# Altium schematic sheet Motor and Encoder.SchDoc
size Tabloid; SheetNumber: 3; SheetTotal: 11
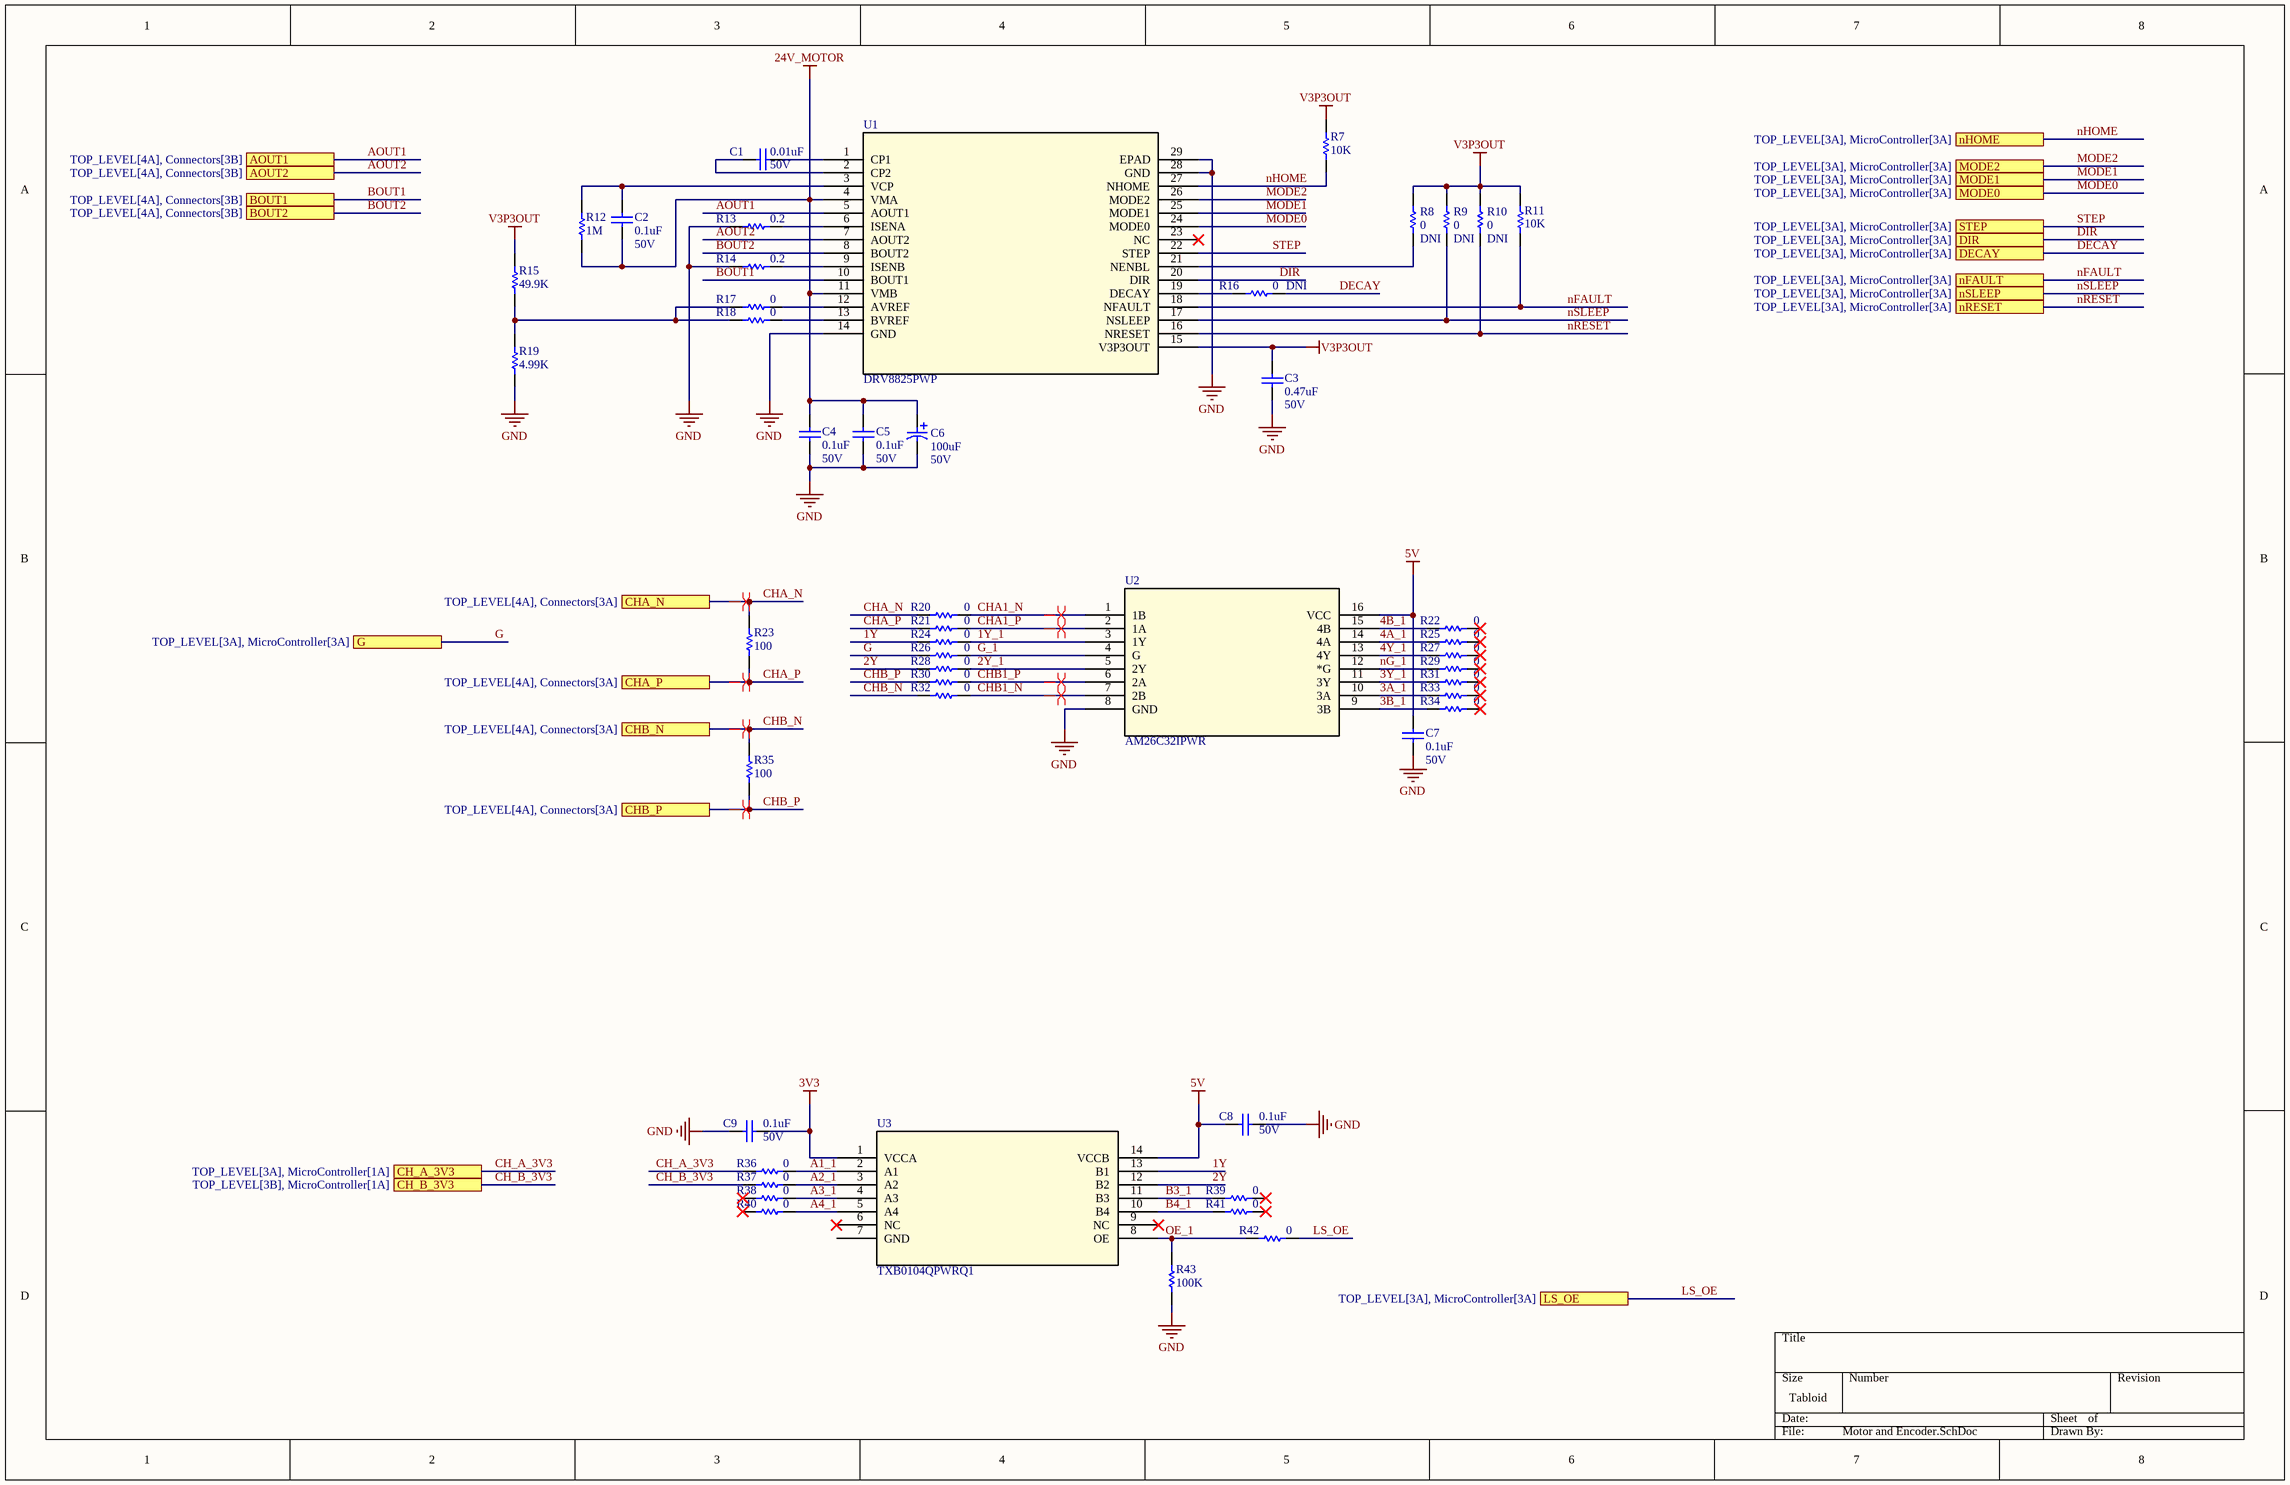
[diagram p0: Motor and Encoder.SchDoc]

## Parts
C1  value 0.01uF  Rating: 50V  [DEFAULT_CAPACITOR_0805]  (hidden comment: KGM21NR71H103KT)
C2  value 0.1uF  Rating: 50V  [DEFAULT_CAPACITOR_0805]  (hidden comment: KGM21NR71H104KT)
C3  value 0.47uF  Rating: 50V  [DEFAULT_CAPACITOR_0805]  (hidden comment: GRM21BR71H474KA88L)
C4  value 0.1uF  Rating: 50V  [DEFAULT_CAPACITOR_0805]  (hidden comment: KGM21NR71H104KT)
C5  value 0.1uF  Rating: 50V  [DEFAULT_CAPACITOR_0805]  (hidden comment: KGM21NR71H104KT)
C6  value 100uF  Rating: 50V  [UWT1H101MNL1GS]  (hidden comment: UWT1H101MNL1GS)
C7  value 0.1uF  Rating: 50V  [DEFAULT_CAPACITOR_0805]  (hidden comment: KGM21NR71H104KT)
C8  value 0.1uF  Rating: 50V  [DEFAULT_CAPACITOR_0805]  (hidden comment: KGM21NR71H104KT)
C9  value 0.1uF  Rating: 50V  [DEFAULT_CAPACITOR_0805]  (hidden comment: KGM21NR71H104KT)
R7  value 10K  [DEFAULT_RESISTOR_0805]  (hidden comment: CRCW080510K0FKEA)
R8  DNI  value 0  [DEFAULT_RESISTOR_0805]
R9  DNI  value 0  [DEFAULT_RESISTOR_0805]
R10  DNI  value 0  [DEFAULT_RESISTOR_0805]
R11  value 10K  [DEFAULT_RESISTOR_0805]  (hidden comment: CRCW080510K0FKEA)
R12  value 1M  [DEFAULT_RESISTOR_0805]  (hidden comment: CRCW08051M00FKEA)
R13  value 0.2  [DEFAULT_RESISTOR_0805]  (hidden comment: ERJ-6DSFR20V)
R14  value 0.2  [DEFAULT_RESISTOR_0805]  (hidden comment: ERJ-6DSFR20V)
R15  value 49.9K  [DEFAULT_RESISTOR_0805]  (hidden comment: RMCF0805FT49K9)
R16  DNI  value 0  [DEFAULT_RESISTOR_0805]
R17  value 0  [DEFAULT_RESISTOR_0805]  (hidden comment: RC0805JR-070RL)
R18  value 0  [DEFAULT_RESISTOR_0805]  (hidden comment: RC0805JR-070RL)
R19  value 4.99K  [DEFAULT_RESISTOR_0805]  (hidden comment: RMCF0805FT4K99)
R20  value 0  [DEFAULT_RESISTOR_0805]  (hidden comment: RC0805JR-070RL)
R21  value 0  [DEFAULT_RESISTOR_0805]  (hidden comment: RC0805JR-070RL)
R22  value 0  [DEFAULT_RESISTOR_0805]  (hidden comment: RC0805JR-070RL)
R23  value 100  [DEFAULT_RESISTOR_0805]  (hidden comment: CRCW0805100RFKEA)
R24  value 0  [DEFAULT_RESISTOR_0805]  (hidden comment: RC0805JR-070RL)
R25  value 0  [DEFAULT_RESISTOR_0805]  (hidden comment: RC0805JR-070RL)
R26  value 0  [DEFAULT_RESISTOR_0805]  (hidden comment: RC0805JR-070RL)
R27  value 0  [DEFAULT_RESISTOR_0805]  (hidden comment: RC0805JR-070RL)
R28  value 0  [DEFAULT_RESISTOR_0805]  (hidden comment: RC0805JR-070RL)
R29  value 0  [DEFAULT_RESISTOR_0805]  (hidden comment: RC0805JR-070RL)
R30  value 0  [DEFAULT_RESISTOR_0805]  (hidden comment: RC0805JR-070RL)
R31  value 0  [DEFAULT_RESISTOR_0805]  (hidden comment: RC0805JR-070RL)
R32  value 0  [DEFAULT_RESISTOR_0805]  (hidden comment: RC0805JR-070RL)
R33  value 0  [DEFAULT_RESISTOR_0805]  (hidden comment: RC0805JR-070RL)
R34  value 0  [DEFAULT_RESISTOR_0805]  (hidden comment: RC0805JR-070RL)
R35  value 100  [DEFAULT_RESISTOR_0805]  (hidden comment: CRCW0805100RFKEA)
R36  value 0  [DEFAULT_RESISTOR_0805]  (hidden comment: RC0805JR-070RL)
R37  value 0  [DEFAULT_RESISTOR_0805]  (hidden comment: RC0805JR-070RL)
R38  value 0  [DEFAULT_RESISTOR_0805]  (hidden comment: RC0805JR-070RL)
R39  value 0  [DEFAULT_RESISTOR_0805]  (hidden comment: RC0805JR-070RL)
R40  value 0  [DEFAULT_RESISTOR_0805]  (hidden comment: RC0805JR-070RL)
R41  value 0  [DEFAULT_RESISTOR_0805]  (hidden comment: RC0805JR-070RL)
R42  value 0  [DEFAULT_RESISTOR_0805]  (hidden comment: RC0805JR-070RL)
R43  value 100K  [DEFAULT_RESISTOR_0805]  (hidden comment: RC0805FR-07100KL)
U1  DRV8825PWP  [DRV8825PWP - 28HTSSTOP]
U2  AM26C32IPWR  [AM26C32IPWR]
U3  TXB0104QPWRQ1  [TXB0104QPWRQ1 - 14TSSOP]

## Ports
AOUT1 (see TOP_LEVEL[4A], Connectors[3B]), AOUT2 (see TOP_LEVEL[4A], Connectors[3B]), BOUT1 (see TOP_LEVEL[4A], Connectors[3B]), BOUT2 (see TOP_LEVEL[4A], Connectors[3B]), CH_A_3V3 (see TOP_LEVEL[3A], MicroController[1A]), CH_B_3V3 (see TOP_LEVEL[3B], MicroController[1A]), CHA_N (see TOP_LEVEL[4A], Connectors[3A]), CHA_P (see TOP_LEVEL[4A], Connectors[3A]), CHB_N (see TOP_LEVEL[4A], Connectors[3A]), CHB_P (see TOP_LEVEL[4A], Connectors[3A]), DECAY (see TOP_LEVEL[3A], MicroController[3A]), DIR (see TOP_LEVEL[3A], MicroController[3A]), G (see TOP_LEVEL[3A], MicroController[3A]), LS_OE (see TOP_LEVEL[3A], MicroController[3A]), MODE0 (see TOP_LEVEL[3A], MicroController[3A]), MODE1 (see TOP_LEVEL[3A], MicroController[3A]), MODE2 (see TOP_LEVEL[3A], MicroController[3A]), nFAULT (see TOP_LEVEL[3A], MicroController[3A]), nHOME (see TOP_LEVEL[3A], MicroController[3A]), nRESET (see TOP_LEVEL[3A], MicroController[3A]), nSLEEP (see TOP_LEVEL[3A], MicroController[3A]), STEP (see TOP_LEVEL[3A], MicroController[3A])

## Nets
3V3: C9.1 U3.1(VCCA)
5V: C7.2 C8.2 U2.16(VCC) U3.14(VCCB)
24V_MOTOR: C2.2 C4.1 C5.1 C6.1 R12.2 U1.4(VMA) U1.11(VMB)
GND: C3.1 C4.2 C5.2 C6.2 C7.1 C8.1 C9.2 R13.2 R14.2 R19.2 R43.2 U1.14(GND) U1.28(GND) U1.29(EPAD) U2.8(GND)
V3P3OUT: C3.2 R7.1 R8.1 R9.1 R10.1 R11.1 R15.1 U1.15(V3P3OUT)
1Y: R24.2 U3.13(B1)
1Y_1: R24.1 U2.3(1Y)
2Y: R28.2 U3.12(B2)
2Y_1: R28.1 U2.5(2Y)
3A_1: R33.2 U2.10(3A)
3B_1: R34.2 U2.9(3B)
3Y_1: R31.2 U2.11(3Y)
4A_1: R25.2 U2.14(4A)
4B_1: R22.2 U2.15(4B)
4Y_1: R27.2 U2.13(4Y)
A1_1: R36.1 U3.2(A1)
A2_1: R37.1 U3.3(A2)
A3_1: R38.1 U3.4(A3)
A4_1: R40.1 U3.5(A4)
AOUT1: U1.5(AOUT1) ; port AOUT1
AOUT2: U1.7(AOUT2) ; port AOUT2
B3_1: R39.2 U3.11(B3)
B4_1: R41.2 U3.10(B4)
BOUT1: U1.10(BOUT1) ; port BOUT1
BOUT2: U1.8(BOUT2) ; port BOUT2
CH_A_3V3: R36.2 ; port CH_A_3V3
CH_B_3V3: R37.2 ; port CH_B_3V3
CHA1_N: R20.1 U2.1(1B)
CHA1_P: R21.1 U2.2(1A)
CHA_N: R20.2 R23.1 ; port CHA_N
CHA_P: R21.2 R23.2 ; port CHA_P
CHB1_N: R32.1 U2.7(2B)
CHB1_P: R30.1 U2.6(2A)
CHB_N: R32.2 R35.1 ; port CHB_N
CHB_P: R30.2 R35.2 ; port CHB_P
DECAY: R16.1 ; port DECAY
DIR: U1.20(DIR) ; port DIR
G: R26.2 ; port G
G_1: R26.1 U2.4(G)
LS_OE: R42.1 ; port LS_OE
MODE0: U1.24(MODE0) ; port MODE0
MODE1: U1.25(MODE1) ; port MODE1
MODE2: U1.26(MODE2) ; port MODE2
nFAULT: R11.2 U1.18(NFAULT) ; port nFAULT
nG_1: R29.2 U2.12(*G)
nHOME: R7.2 U1.27(NHOME) ; port nHOME
nRESET: R10.2 U1.16(NRESET) ; port nRESET
nSLEEP: R9.2 U1.17(NSLEEP) ; port nSLEEP
OE_1: R42.2 R43.1 U3.8(OE)
STEP: U1.22(STEP) ; port STEP
NetC1_1: C1.1 U1.1(CP1)
NetC1_2: C1.2 U1.2(CP2)
NetC2_1: C2.1 R12.1 U1.3(VCP)
NetR8_2: R8.2 U1.21(NENBL)
NetR13_1: R13.1 U1.6(ISENA)
NetR14_1: R14.1 U1.9(ISENB)
NetR15_2: R15.2 R17.2 R18.2 R19.1
NetR16_2: R16.2 U1.19(DECAY)
NetR17_1: R17.1 U1.12(AVREF)
NetR18_1: R18.1 U1.13(BVREF)

Not connected (* = marked no-connect by the designer): R22 1*; R25 1*; R27 1*; R29 1*; R31 1*; R33 1*; R34 1*; R38 2*; R39 1*; R40 2*; R41 1*; U1 23(NC)*; U3 6(NC)* 7(GND) 9(NC)*

## Layout directives
differential pair: CHA1_N, CHA1_P, CHA_N, CHA_P, CHB1_N, CHB1_P, CHB_N, CHB_P

## Library data of the parts
C1 = KGM21NR71H103KT: CAP CER 10000PF 50V X7R 0805; Manufacturer: Cal-Chip Electronics, Inc.; Manufacturer P/N: GMC55X7R226M50NT; MFR PN: KGM21NR71H103KT
C2 C4 C5 C7-C9 = KGM21NR71H104KT: CAP CER 0.1UF 50V X7R 0805; Manufacturer: Cal-Chip Electronics, Inc.; Manufacturer P/N: GMC55X7R226M50NT; MFR PN: KGM21NR71H104KT
C3 = GRM21BR71H474KA88L: CAP CER 0.47UF 50V X7R 0805; Manufacturer: Cal-Chip Electronics, Inc.; Manufacturer P/N: GMC55X7R226M50NT; MFR PN: GRM21BR71H474KA88L
C6 = UWT1H101MNL1GS: CAP ALUM 100UF 20% 50V SMD; Manufacturer_Name: Nichicon; Copyright: Copyright (C) 2026 Ultra Librarian. All rights reserved.; Manufacturer_Part_Number: UWT1H101MNL1GS; MFR PN: UWT1H101MNL1GS
R7 R11 = CRCW080510K0FKEA: RES SMD 10K OHM 1% 1/4W 0805; Power: 1/4W; MFR PN: CRCW080510K0FKEA; Tolerance: 1%
R8-R10 R16-R18 R20-R22 R24-R34 R36-R42 = RC0805JR-070RL: RES 0 OHM JUMPER 1/8W 0805; Power: 1/8W; MFR PN: RC0805JR-070RL; Tolerance: *
R12 = CRCW08051M00FKEA: RES SMD 1M OHM 1% 1/4W 0805; Power: 1/4W; MFR PN: CRCW08051M00FKEA; Tolerance: 1%
R13 R14 = ERJ-6DSFR20V: RES 0.2 OHM 1% 1/2W 0805; MFR PN: ERJ-6DSFR20V; Tolerance: 1%
R15 = RMCF0805FT49K9: RES 49.9K OHM 1% 1/8W 0805; Power: 1/8W; MFR PN: RMCF0805FT49K9; Tolerance: 1%
R19 = RMCF0805FT4K99: RES 4.99K OHM 1% 1/8W 0805; Power: 1/8W; MFR PN: RMCF0805FT4K99; Tolerance: 1%
R23 R35 = CRCW0805100RFKEA: RES SMD 100 OHM 1% 1/4W 0805; Power: 1/4W; MFR PN: CRCW0805100RFKEA; Tolerance: 1%
R43 = RC0805FR-07100KL: RES 100K OHM 1% 1/8W 0805; Power: 1/8W; MFR PN: RC0805FR-07100KL; Tolerance: 1%
U1 = DRV8825PWP: 45-V, 2.5-A bipolar stepper motor driver with current regulation and 1/32 microstepping Â  28-HTSSOP -40 to 85; Manufacturer_Name: Texas Instruments; Copyright: Copyright (C) 2026 Ultra Librarian. All rights reserved.; Manufacturer_Part_Number: DRV8825PWP; RefDes: RefDes; Type: Type; MFR PN: DRV8825PWP
U2 = AM26C32IPWR: Quadruple Differential Line Receiver 16-TSSOP -40 to 85; Manufacturer_Name: Texas Instruments; Copyright: Copyright (C) 2025 Ultra Librarian. All rights reserved.; Manufacturer_Part_Number: AM26C32IPWR; RefDes: RefDes; Type: Type; MFR PN: AM26C32IPWR
U3 = TXB0104QPWRQ1: Automotive 4-bit bidirectional voltage-level translator with auto direction sensing and +/-15kV ESD 14-TSSOP -40 to 125; Manufacturer_Name: Texas Instruments; Copyright: Copyright (C) 2025 Ultra Librarian. All rights reserved.; Manufacturer_Part_Number: TXB0104QPWRQ1; RefDes: RefDes; Type: Type; MFR PN: TXB0104QPWRQ1